# Altium schematic sheet Capacitance Sensing.SchDoc: Capacitance Sensing
size A4; Organization: University of Colorado; Address1: 1111 Engineering Drive; Address2: Boulder; Address3: CO, 870309; Address4: USA; DocumentNumber: 1; Revision: 1; SheetNumber: 2; SheetTotal: 4; DocumentName: Capacitance Sensing.SchDoc
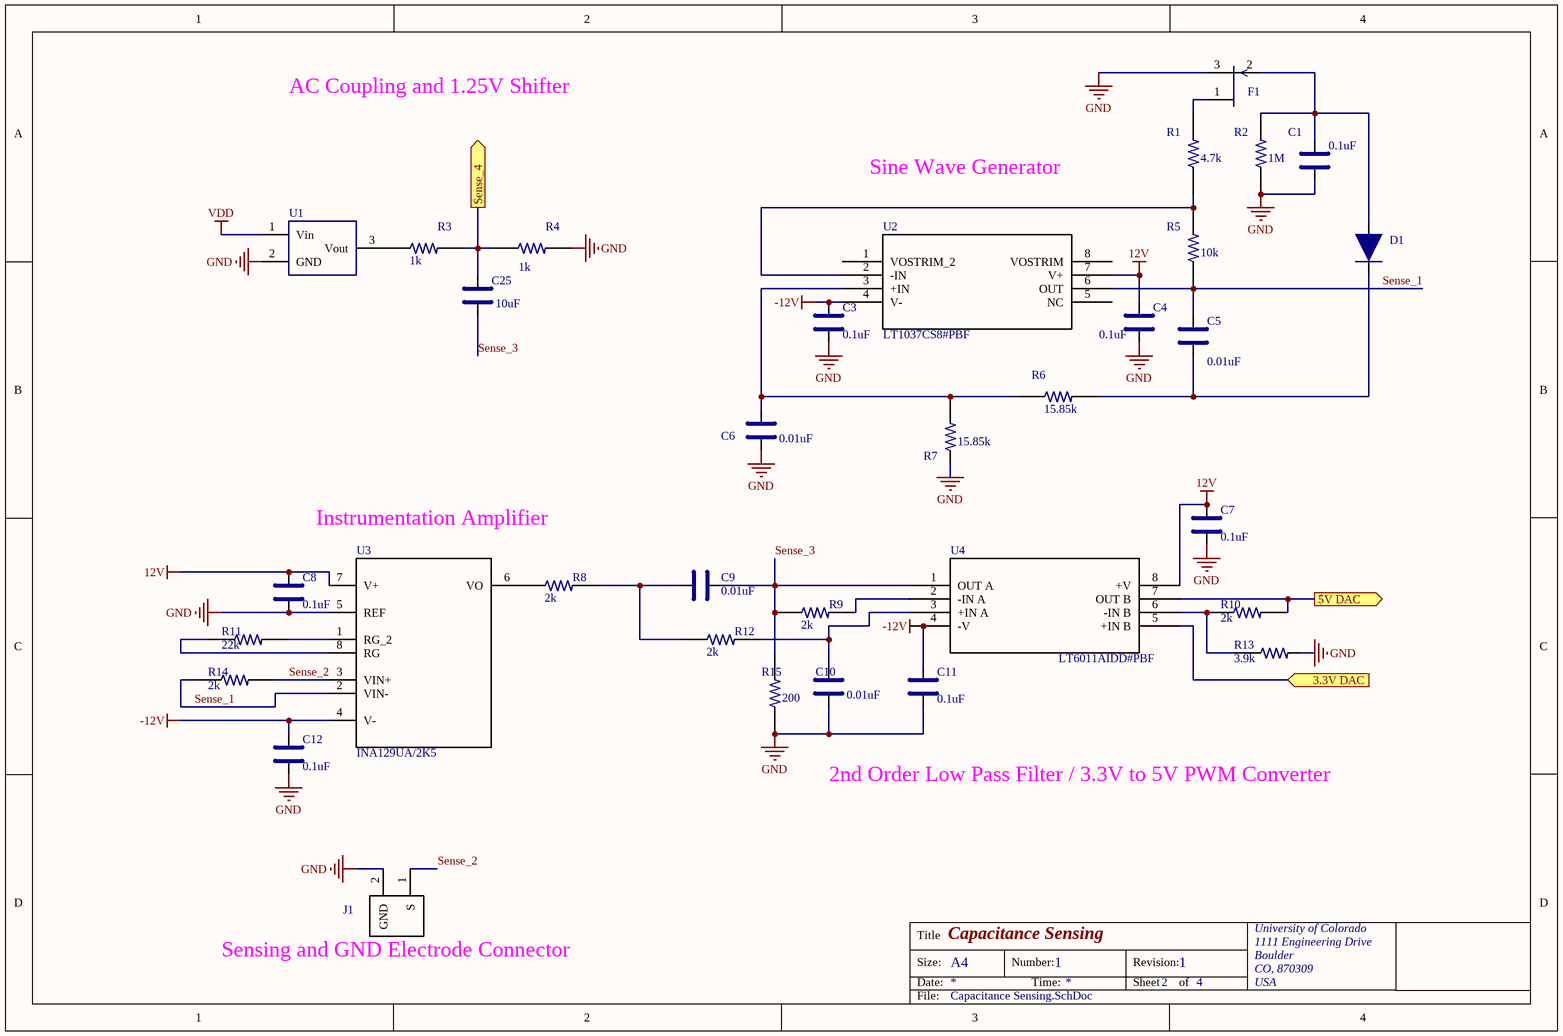
[diagram p0: Capacitance Sensing.SchDoc]

## Parts
C1  value 0.1uF  [CL03A104KA3NNNC]  (hidden comment: CL03A104KA3NNNC)
C3  value 0.1uF  [CL03A104KA3NNNC]  (hidden comment: CL03A104KA3NNNC)
C4  value 0.1uF  [CL03A104KA3NNNC]  (hidden comment: CL03A104KA3NNNC)
C5  value 0.01uF  [CL03B103KP3NNNC]  (hidden comment: CL03B103KP3NNNC)
C6  value 0.01uF  [CL03B103KP3NNNC]  (hidden comment: CL03B103KP3NNNC)
C7  value 0.1uF  [CL03A104KA3NNNC]  (hidden comment: CL03A104KA3NNNC)
C8  value 0.1uF  [CL03A104KA3NNNC]  (hidden comment: CL03A104KA3NNNC)
C9  value 0.01uF  [CL03B103KP3NNNC]  (hidden comment: CL03B103KP3NNNC)
C10  value 0.01uF  [CL03B103KP3NNNC]  (hidden comment: CL03B103KP3NNNC)
C11  value 0.1uF  [CL03A104KA3NNNC]  (hidden comment: CL03A104KA3NNNC)
C12  value 0.1uF  [CL03A104KA3NNNC]  (hidden comment: CL03A104KA3NNNC)
C25  value 10uF  [GRM155R60J106ME47D]  (hidden comment: GRM155R60J106ME47D)
D1  1N4148W-7-F  [1N4148W-7-F]  (value not drawn)
F1  U309  [U309]  (value not drawn)
J1  SM02B-SRSS-TB  [SM02B-SRSS-TB(LF)(SN)]  (value not drawn)
R1  value 4.7k  [RC0603J472CS]  (hidden comment: RC0603J472CS)
R2  value 1M  [AC0201FR-071ML]  (hidden comment: AC0201FR-071ML)
R3  value 1k  [RC0201FR-07130KL]  (hidden comment: RC0201FR-07130KL)
R4  value 1k  [RC0201FR-07130KL]  (hidden comment: RC0201FR-07130KL)
R5  value 10k  [RC0603F103CS]  (hidden comment: RC0603F103CS)
R6  value 15.85k  [RMCF0201FT15K8]  (hidden comment: RMCF0201FT15K8)
R7  value 15.85k  [RMCF0201FT15K8]  (hidden comment: RMCF0201FT15K8)
R8  value 2k  [RC0603F202CS]  (hidden comment: RC0603F202CS)
R9  value 2k  [RC0603F202CS]  (hidden comment: RC0603F202CS)
R10  value 2k  [RC0603F202CS]  (hidden comment: RC0603F202CS)
R11  value 22k  [ERJ-1GNJ223C]  (hidden comment: ERJ-1GNJ223C)
R12  value 2k  [RC0603F202CS]  (hidden comment: RC0603F202CS)
R13  value 3.9k  [RC0603F202CS]  (hidden comment: RC0603F202CS)
R14  value 2k  [RC0603F202CS]  (hidden comment: RC0603F202CS)
R15  value 200  [RC0603F202CS]  (hidden comment: RC0603F202CS)
U1  ISL60002BIH325Z-T7A  [ISL60002-25]  (value not drawn)
U2  LT1037CS8#PBF  [LT1037CS8#PBF]
U3  INA129UA/2K5  [INA129UA/2K5]
U4  LT6011AIDD#PBF  [ADP7104ACPZ-3.3-R7]

## Ports
3.3V DAC (in), 5V DAC (out), Sense_4 (out)

## Nets
12V: C4.1 C7.1 C8.1 U2.7(V+) U3.7(V+) U4.8(+V)
-12V: C3.1 C11.1 C12.1 U2.4(V-) U3.4(V-) U4.4(-V)
GND: C1.2 C3.2 C4.2 C6.2 C7.2 C8.2 C10.2 C11.2 C12.2 F1.3(S) J1.2(GND) R2.2 R4.1 R7.2 R13.1 R15.2 U1.2(GND) U3.5(REF)
VDD: U1.1(Vin)
3.3V DAC: U4.5(+IN_B) ; port 3.3V DAC
5V DAC: R10.1 U4.7(OUT_B) ; port 5V DAC
Sense_1: C5.1 R5.2 R14.2 U2.6(OUT) U3.2(VIN-)
Sense_2: J1.1(S) R14.1 U3.3(VIN+)
Sense_3: C9.1 C25.2 R9.2 R15.1 U4.1(OUT_A)
Sense_4: C25.1 R3.1 R4.2 ; port Sense_4
NetC1_1: C1.1 D1.2 F1.2(G) R2.1
NetC5_2: C5.2 D1.1 R6.1
NetC6_1: C6.1 R6.2 R7.1 U2.3(+IN)
NetC9_2: C9.2 R8.1 R12.2
NetC10_1: C10.1 R12.1 U4.3(+IN_A)
NetF1_1: F1.1(D) R1.1
NetR1_2: R1.2 R5.1 U2.2(-IN)
NetR3_2: R3.2 U1.3(Vout)
NetR8_2: R8.2 U3.6(VO)
NetR9_1: R9.1 U4.2(-IN_A)
NetR10_2: R10.2 R13.2 U4.6(-IN_B)
NetR11_1: R11.1 U3.1(RG_2)
NetR11_2: R11.2 U3.8(RG)

Not connected (* = marked no-connect by the designer): U2 1(VOSTRIM_2) 5(NC) 8(VOSTRIM)

## Notes on the sheet
- AC Coupling and 1.25V Shifter
- Sine Wave Generator
- Instrumentation Amplifier
- 2nd Order Low Pass Filter / 3.3V to 5V PWM Converter
- (near J1) Sensing and GND Electrode Connector
- Title
- Size:
- Date:
- A4
- Number:
- Time:
- Revision:
- Sheet
- of
- File:

## Library data of the parts
C1 C3 C4 C7 C8 C11 C12 = CL03A104KA3NNNC: CAP CER 0.1UF 25V X5R 0201; Manufacturer: Samsung; Package: 0201 (0603 Metric); Manufacturer Part Number: CL03A104KA3NNNC; Digikey Part Number: 1276-1318-6-ND; Voltage Rated: 25V; Temperature Coefficient: X5R; Unit Price: $0.75; Supplier: Digikey
C5 C6 C9 C10 = CL03B103KP3NNNC: CAP CER 10000PF 10V X7R 0201; Manufacturer: Samsung; Package: 0201 (0603 Metric); Manufacturer Part Number: CL03B103KP3NNNC; Digikey Part Number: 1276-1152-1-ND; Voltage Rated: 10V; Temperature Coefficient: X7R; Unit Price: 0.13; Supplier: Digikey
C25 = GRM155R60J106ME47D: CAP CER 10UF 6.3V X5R 0402; Manufacturer: Murata; Package: 0402 (1005 Metric); Manufacturer Part Number: GRM155R60J106ME47D; Digikey Part Number: 490-13239-1-ND; Voltage Rated: 6.3V; Temperature Coefficient: X5R; Unit Price: $0.85; Supplier: Digikey
D1 = 1N4148W-7-F: DIODE GEN PURP 100V 300MA SOD123; Manufacturer: Diodes Incorporated; Forward Voltage: 1.25V @ 150mA; Package: 0201 (0603 Metric); Manufacturer Part Number: 1N4148W-7-F; Digikey Part Number: 1N4148W-FDICT-ND; Unit Price: $0.18; Supplier: Digikey; DC Reverse: 100V
F1 = U309: JFET JFET N-Channel -25V 20mA 500mW 4mW; Manufacturer: InterFET; Package: TO-52-3; Manufacturer Part Number: U309; Digikey Part Number: 106-U309; Unit Price: $6.00; Supplier: Mouser
J1 = SM02B-SRSS-TB(LF)(SN): SH Series 2 Position 1 mm Pitch Surface Mount Side Entry Shrouded Header; MP: SM02B-SRSS-TB_LF__SN_; MF: JST; SnapEDA_Link: https://www.snapeda.com/parts/SM02B-SRSS-TB%28LF%29%28SN%29/JST%20Sales%20America%20Inc/view-part/?ref=snap; Package: None; Price: 0.24 USD; Availability: Good; Value: *
R1 = RC0603J472CS: RES SMD 4.7K OHM 5% 1/20W 0201; Manufacturer: Samsung; Power (Watts): 0.05W; Package: 0201 (0603 Metric); Manufacturer Part Number: RC0603J472CS; Digikey Part Number: 1276-3810-1-ND; Unit Price: 0.1; Supplier: Digikey
R2 = AC0201FR-071ML: RES SMD 1M OHM 1% 1/20W 0201; Manufacturer: Yageo; Power (Watts): 0.05W; Package: 0201 (0603 Metric); Manufacturer Part Number: AC0201FR-071ML; Digikey Part Number: YAG3418CT-ND; Unit Price: 0.1; Supplier: Digikey
R3 R4 = RC0201FR-07130KL: RES SMD 130K OHM 1% 1/20W 0201; Manufacturer: Yageo; Power (Watts): 0.05W; Package: 0201 (0603 Metric); Manufacturer Part Number: RC0201FR-07130KL; Digikey Part Number: YAG2393DKR-ND; Unit Price: 0.1; Supplier: Digikey
R5 = RC0603F103CS: RES SMD 10K OHM 1% 1/20W 0201; Manufacturer: Samsung; Power (Watts): 0.05W; Package: 0201 (0603 Metric); Manufacturer Part Number: RC0603F103CS; Digikey Part Number: YAG2407CT-ND; Unit Price: 0.1; Supplier: Digikey
R6 R7 = RMCF0201FT15K8: RES 15.8K OHM 1% 1/20W 0201; Manufacturer: Stackpole; Power (Watts): 0.05W; Package: 0201 (0603 Metric); Manufacturer Part Number: RMCF0201FT15K8; Digikey Part Number: RMCF0201FT15K8CT-ND; Unit Price: $0.1; Supplier: Digikey
R8-R10 R12-R15 = RC0603F202CS: RES SMD 2K OHM 1% 1/20W 0201; Manufacturer: Samsung; Power (Watts): 0.05W; Package: 0201 (0603 Metric); Manufacturer Part Number: RC0603F202CS; Digikey Part Number: 1276-3633-1-ND; Unit Price: 0.1; Supplier: Digikey
R11 = ERJ-1GNJ223C: RES SMD 22K OHM 5% 1/20W 0201; Manufacturer: Samsung; Power (Watts): 0.05W; Package: 0201 (0603 Metric); Manufacturer Part Number: ERJ-1GNJ223C; Digikey Part Number: P123278CT-ND; Unit Price: 0.1; Supplier: Digikey
U1 = ISL60002BIH325Z-T7A: IC VREF SERIES 2.5V SOT23-3; Manufacturer: Renesas Electronics; Manufacturer Part Number: ISL60002BIH325Z-TK; Package: SOT-23-3; Digikey Part Number: ISL60002BIH325Z-T7ADKR-ND; Unit Price: $6.41; Supplier: Digikey
U2 = LT1037CS8#PBF: IC OPAMP GP 60MHZ 8SO; Manufacturer: Linear Technology; Value: 15.85k; Package: 8-SOIC; Manufacturer Part Number: LT1037CS8#PBF; Digikey Part Number: LT1037CS8#PBF-ND; Unit Price: $4.23; Supplier: Digikey
U3 = INA129UA/2K5: IC OPAMP INSTR 1.3MHZ 8SOIC; Manufacturer: Texas Instruments; Package: 8-SOIC; Manufacturer Part Number: INA129UA/2K5; Digikey Part Number: 296-26058-1-ND; Unit Price: $7.46; Supplier: Digikey
U4 = LT6011AIDD#PBF: IC OPAMP GP 350KHZ RRO 8DFN; Manufacturer: Analog Device; Package: 8 DFN; Manufacturer Part Number: LT6011AIDD#PBF; Digikey Part Number: LT6011AIDD#PBF-ND; Unit Price: $8.43; Supplier: Digikey